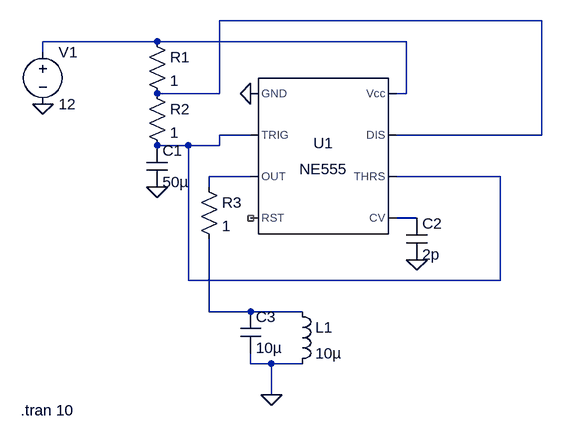
[diagram p0: schematic Draft3.asc]
Draft3.asc, the LTspice schematic file:
Version 4
SHEET 1 880 680
WIRE 560 -32 64 -32
WIRE -32 0 -208 0
WIRE 352 0 -32 0
WIRE -208 16 -208 0
WIRE 64 80 64 -32
WIRE 64 80 -32 80
WIRE 352 80 352 0
WIRE 352 80 336 80
WIRE 112 144 64 144
WIRE 560 144 560 -32
WIRE 560 144 336 144
WIRE 16 160 -32 160
WIRE 64 160 64 144
WIRE 64 160 16 160
WIRE 112 208 48 208
WIRE 496 208 336 208
WIRE 48 224 48 208
WIRE 368 272 336 272
WIRE 16 368 16 160
WIRE 496 368 496 208
WIRE 496 368 16 368
WIRE 48 416 48 304
WIRE 112 416 48 416
WIRE 192 416 112 416
WIRE 112 496 112 480
WIRE 144 496 112 496
WIRE 192 496 144 496
WIRE 144 544 144 496
FLAG -32 224 0
FLAG 112 80 0
FLAG -208 96 0
FLAG 144 544 0
FLAG 368 336 0
SYMBOL Misc\\NE555 224 176 R0
SYMATTR InstName U1
SYMBOL res -48 -16 R0
SYMATTR InstName R1
SYMATTR Value 1
SYMBOL res -48 64 R0
SYMATTR InstName R2
SYMATTR Value 1
SYMBOL cap -48 160 R0
SYMATTR InstName C1
SYMATTR Value 50µ
SYMBOL res 32 208 R0
SYMATTR InstName R3
SYMATTR Value 1
SYMBOL cap 352 272 R0
SYMATTR InstName C2
SYMATTR Value 2p
SYMBOL voltage -208 0 R0
WINDOW 123 0 0 Left 0
WINDOW 39 0 0 Left 0
SYMATTR InstName V1
SYMATTR Value 12
SYMBOL cap 96 416 R0
SYMATTR InstName C3
SYMATTR Value 10µ
SYMBOL ind 176 400 R0
SYMATTR InstName L1
SYMATTR Value 10µ
TEXT -242 568 Left 2 !.tran 10

The netlist it stands for:
* Draft3.asc
XU1 0 N003 N004 NC_01 N005 N003 N001 N002 NE555  ; pins GND TRIG OUT RST CV THRS DIS Vcc
R1 N002 N001 1
R2 N001 N003 1
C1 N003 0 50µ
R3 N004 N006 1
C2 N005 0 2p
V1 N002 0 12
C3 N006 0 10µ
L1 N006 0 10µ
.tran 10
.lib NE555.sub
.backanno
.end